# Altium project DHA-3v15.PrjPcb (part 1 of 3)
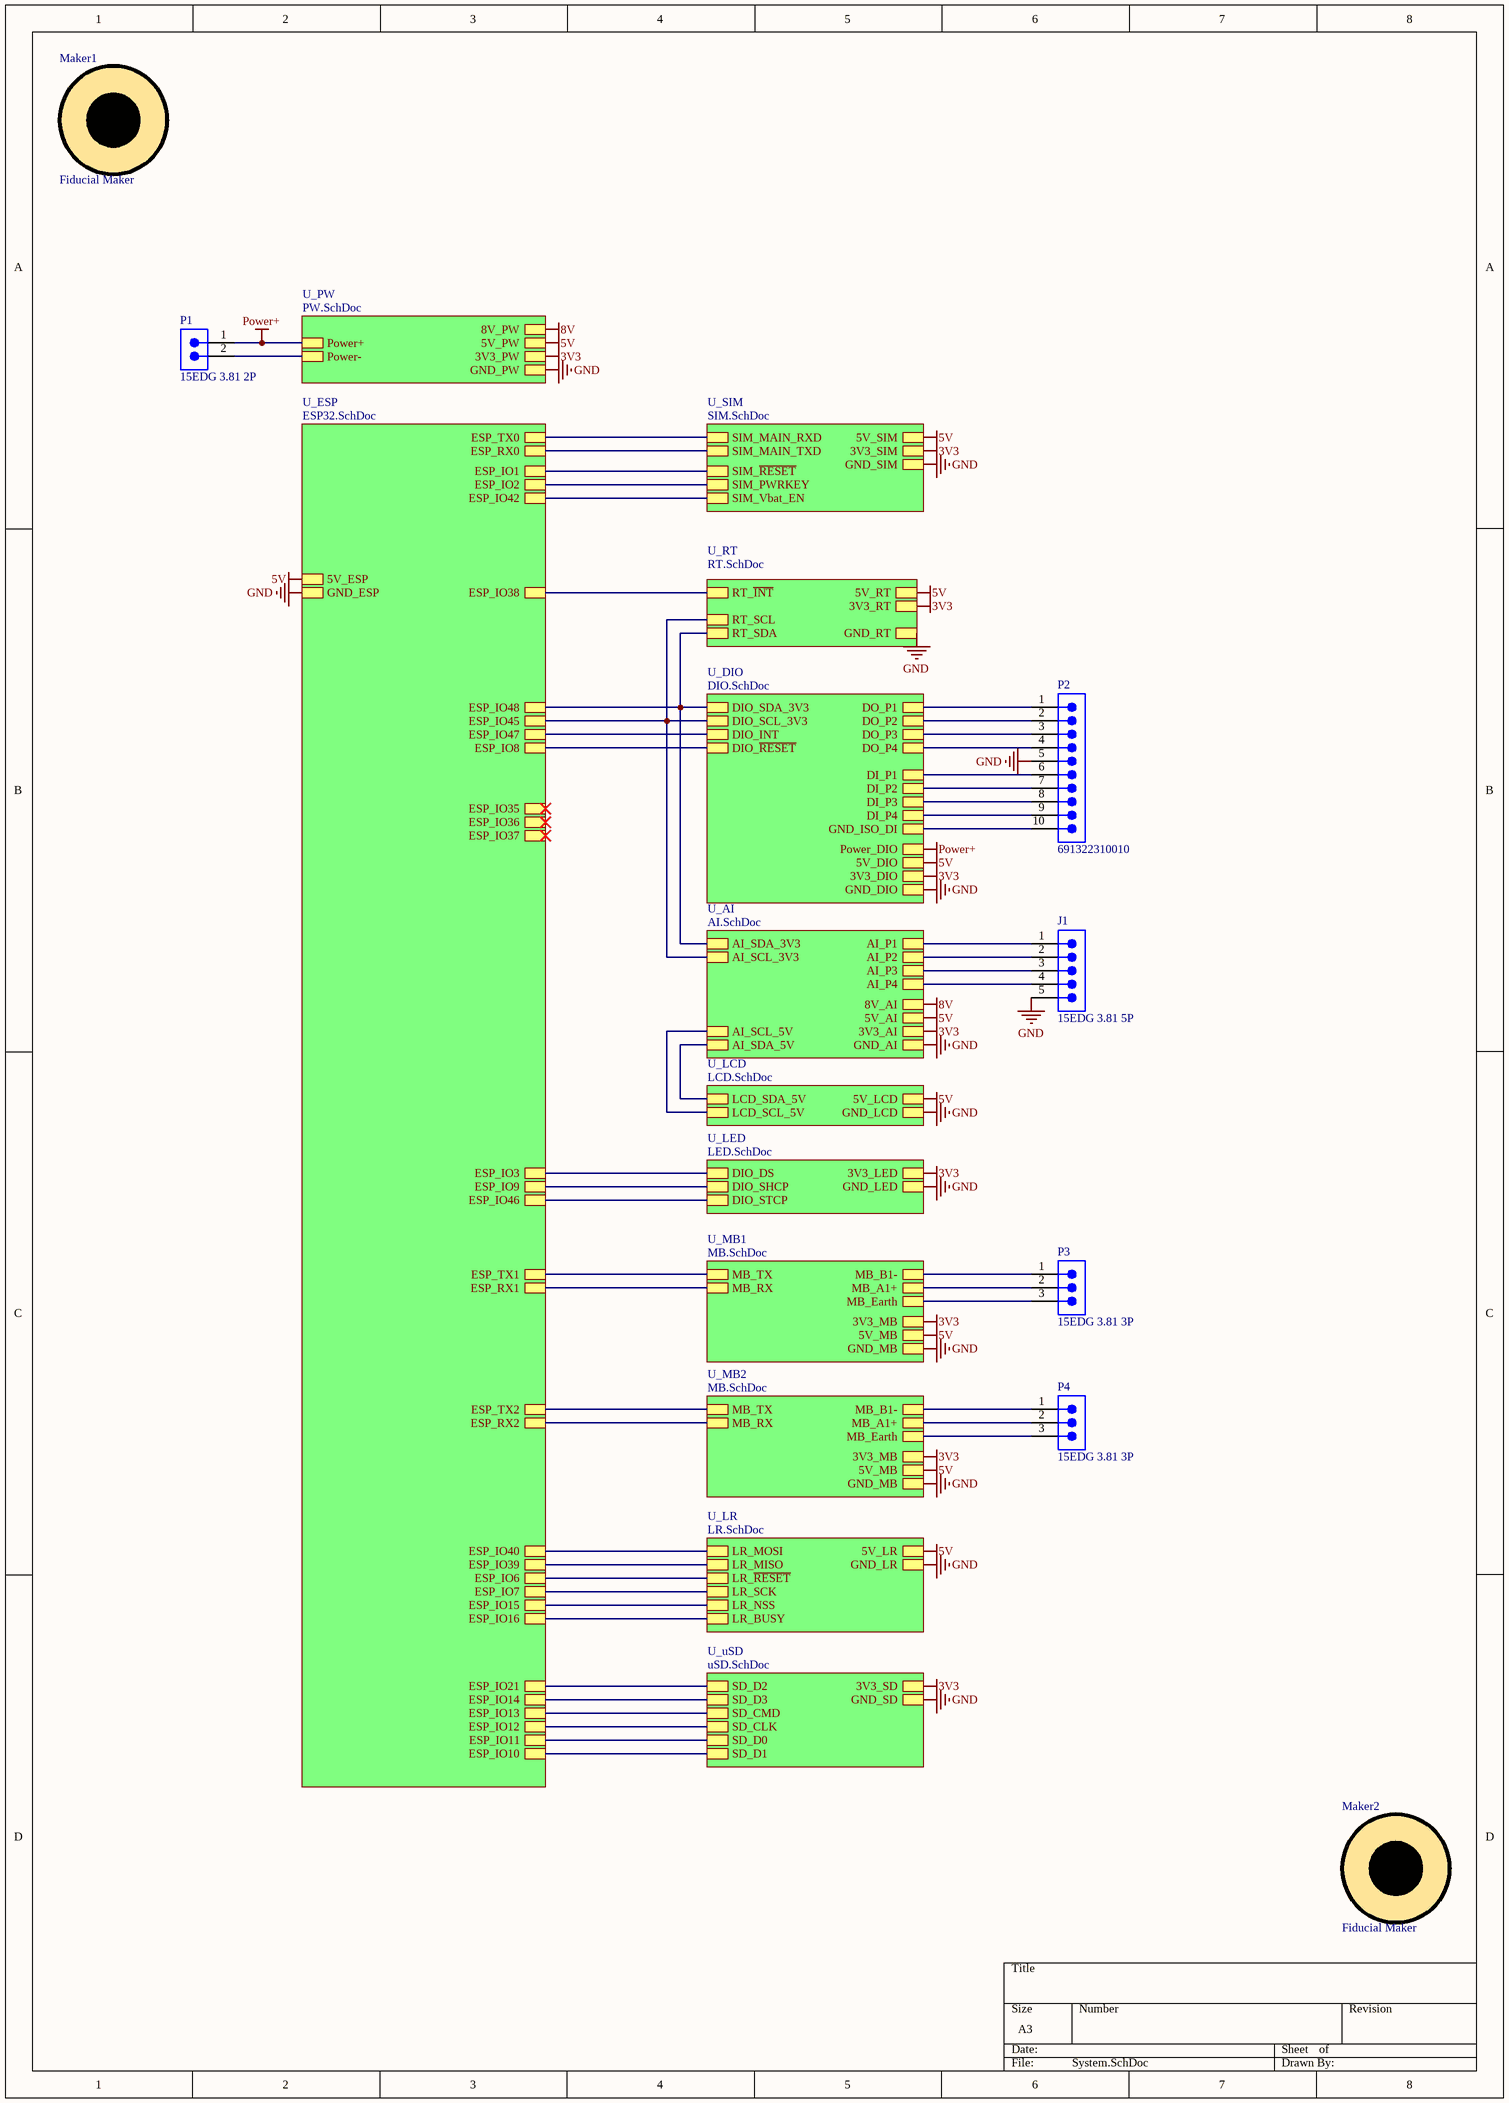
[diagram p0: System.SchDoc]
15 sheets, 321 parts. Net scope: hierarchical (ports join the sheet entries above them; power ports are global).
Board file: DHA-3v15.PcbDoc
Sheets:
  System.SchDoc
    U_MB1 = MB.SchDoc
    U_LR = LR.SchDoc
    U_uSD = uSD.SchDoc
    U_ESP = ESP32.SchDoc
    U_AI = AI.SchDoc
    U_PW = PW.SchDoc
      U_IP = IP.SchDoc
    U_SIM = SIM.SchDoc
    U_MB2 = MB.SchDoc
    U_LCD = LCD.SchDoc
    U_LED = LED.SchDoc
    U_DIO = DIO.SchDoc
      U_DO = DO.SchDoc
      U_DI = DI.SchDoc
    U_RT = RT.SchDoc

## Sheet System.SchDoc
size A3 portrait; SheetNumber: 1; SheetTotal: 15

### Parts
J1  15EDG 3.81 5P  [691322310005]
Maker1  Fiducial Maker  [Fiducial Maker]
Maker2  Fiducial Maker  [Fiducial Maker]
P1  15EDG 3.81 2P  [691322310002]
P2  691322310010  [691322310010]
P3  15EDG 3.81 3P  [691322310003]
P4  15EDG 3.81 3P  [691322310003]

### Sub-sheets
U_AI = AI.SchDoc: 3V3_AI, GND_AI, 8V_AI, 5V_AI, AI_P1, AI_P2, AI_P3, AI_P4, AI_SCL_5V, AI_SDA_5V, AI_SCL_3V3, AI_SDA_3V3
U_DIO = DIO.SchDoc: DIO_SCL_3V3, DIO_SDA_3V3, Power_DIO, 5V_DIO, 3V3_DIO, GND_DIO, DIO_INT, DO_P1, DO_P2, DO_P3, DO_P4, DI_P1, DI_P2, DI_P3, DI_P4, DIO_~{RESET}, GND_ISO_DI
U_ESP = ESP32.SchDoc: ESP_IO40, ESP_IO39, ESP_IO48, ESP_IO10, ESP_IO11, ESP_IO12, ESP_IO13, ESP_IO14, ESP_IO21, 5V_ESP, GND_ESP, ESP_RX2, ESP_TX2, ESP_IO47, ESP_TX1, ESP_RX1, ESP_IO3, ESP_IO45, ESP_IO8, ESP_IO6, ESP_IO15, ESP_IO16, ESP_IO7, ESP_IO9, ESP_IO46, ESP_IO35, ESP_IO36, ESP_IO37, ESP_IO38, ESP_RX0, ESP_TX0, ESP_IO1, ESP_IO42, ESP_IO2
U_LCD = LCD.SchDoc: GND_LCD, 5V_LCD, LCD_SDA_5V, LCD_SCL_5V
U_LED = LED.SchDoc: GND_LED, DIO_DS, DIO_SHCP, DIO_STCP, 3V3_LED
U_LR = LR.SchDoc: 5V_LR, GND_LR, LR_MISO, LR_SCK, LR_NSS, LR_BUSY, LR_~{RESET}, LR_MOSI
U_MB1 = MB.SchDoc: 5V_MB, GND_MB, MB_TX, MB_RX, MB_A1+, MB_B1-, MB_Earth, 3V3_MB
U_MB2 = MB.SchDoc: 5V_MB, GND_MB, MB_TX, MB_RX, MB_A1+, MB_B1-, MB_Earth, 3V3_MB
U_PW = PW.SchDoc: Power+, Power-, 5V_PW, GND_PW, 3V3_PW, 8V_PW
U_RT = RT.SchDoc: 3V3_RT, GND_RT, RT_SCL, RT_SDA, 5V_RT, RT_~{INT}
U_SIM = SIM.SchDoc: SIM_Vbat_EN, SIM_~{RESET}, SIM_MAIN_RXD, SIM_MAIN_TXD, 5V_SIM, GND_SIM, SIM_PWRKEY, 3V3_SIM
U_uSD = uSD.SchDoc: 3V3_SD, SD_D0, SD_D1, SD_D2, SD_D3, SD_CMD, SD_CLK, GND_SD

### Nets
3V3: sheet U_MB1/3V3_MB, sheet U_uSD/3V3_SD, sheet U_AI/3V3_AI, sheet U_PW/3V3_PW, sheet U_SIM/3V3_SIM, sheet U_MB2/3V3_MB, sheet U_LED/3V3_LED, sheet U_DIO/3V3_DIO, sheet U_RT/3V3_RT
5V: sheet U_MB1/5V_MB, sheet U_LR/5V_LR, sheet U_ESP/5V_ESP, sheet U_AI/5V_AI, sheet U_PW/5V_PW, sheet U_SIM/5V_SIM, sheet U_MB2/5V_MB, sheet U_LCD/5V_LCD, sheet U_DIO/5V_DIO, sheet U_RT/5V_RT
8V: sheet U_AI/8V_AI, sheet U_PW/8V_PW
GND: J1.5 P2.5 ; sheet U_MB1/GND_MB, sheet U_LR/GND_LR, sheet U_uSD/GND_SD, sheet U_ESP/GND_ESP, sheet U_AI/GND_AI, sheet U_PW/GND_PW, sheet U_SIM/GND_SIM, sheet U_MB2/GND_MB, sheet U_LCD/GND_LCD, sheet U_LED/GND_LED, sheet U_DIO/GND_DIO, sheet U_RT/GND_RT
GND_ISO_DI: P2.10 ; sheet U_DIO/GND_ISO_DI
Power+: P1.1 ; sheet U_PW/Power+, sheet U_DIO/Power_DIO
AI_P1: J1.1 ; sheet U_AI/AI_P1
AI_P2: J1.2 ; sheet U_AI/AI_P2
AI_P3: J1.3 ; sheet U_AI/AI_P3
AI_P4: J1.4 ; sheet U_AI/AI_P4
AI_SCL_3V3: sheet U_ESP/ESP_IO45, sheet U_AI/AI_SCL_3V3, sheet U_DIO/DIO_SCL_3V3, sheet U_RT/RT_SCL
AI_SCL_5V: sheet U_AI/AI_SCL_5V, sheet U_LCD/LCD_SCL_5V
AI_SDA_3V3: sheet U_ESP/ESP_IO48, sheet U_AI/AI_SDA_3V3, sheet U_DIO/DIO_SDA_3V3, sheet U_RT/RT_SDA
AI_SDA_5V: sheet U_AI/AI_SDA_5V, sheet U_LCD/LCD_SDA_5V
Earth1: P4.3 ; sheet U_MB2/MB_Earth
Earth1: P3.3 ; sheet U_MB1/MB_Earth  [a separate net that carries the same name]
LR_BUSY: sheet U_LR/LR_BUSY, sheet U_ESP/ESP_IO16
LR_MISO: sheet U_LR/LR_MISO, sheet U_ESP/ESP_IO39
LR_MOSI: sheet U_LR/LR_MOSI, sheet U_ESP/ESP_IO40
LR_NSS: sheet U_LR/LR_NSS, sheet U_ESP/ESP_IO15
LR_~{RESET}: sheet U_LR/LR_~{RESET}, sheet U_ESP/ESP_IO6
LR_SCK: sheet U_LR/LR_SCK, sheet U_ESP/ESP_IO7
MB_A1+: P4.2 ; sheet U_MB2/MB_A1+
MB_A1+: P3.2 ; sheet U_MB1/MB_A1+  [a separate net that carries the same name]
MB_B1-: P4.1 ; sheet U_MB2/MB_B1-
MB_B1-: P3.1 ; sheet U_MB1/MB_B1-  [a separate net that carries the same name]
SD_CLK: sheet U_uSD/SD_CLK, sheet U_ESP/ESP_IO12
SD_CMD: sheet U_uSD/SD_CMD, sheet U_ESP/ESP_IO13
SD_D0: sheet U_uSD/SD_D0, sheet U_ESP/ESP_IO11
SD_D1: sheet U_uSD/SD_D1, sheet U_ESP/ESP_IO10
SD_D2: sheet U_uSD/SD_D2, sheet U_ESP/ESP_IO21
SD_D3: sheet U_uSD/SD_D3, sheet U_ESP/ESP_IO14
NetD10_2: P2.1 ; sheet U_DIO/DO_P1
NetD12_2: P2.2 ; sheet U_DIO/DO_P2
NetD14_2: P2.3 ; sheet U_DIO/DO_P3
NetD16_2: P2.4 ; sheet U_DIO/DO_P4
NetD20_1: P1.2 ; sheet U_PW/Power-
NetDIBF_D1_2: P2.6 ; sheet U_DIO/DI_P1
NetDIBF_D2_2: P2.7 ; sheet U_DIO/DI_P2
NetDIBF_D3_2: P2.8 ; sheet U_DIO/DI_P3
NetDIBF_D4_2: P2.9 ; sheet U_DIO/DI_P4
NetMB_U1_U_MB1_1: sheet U_MB1/MB_TX, sheet U_ESP/ESP_TX1
NetMB_U1_U_MB2_1: sheet U_ESP/ESP_TX2, sheet U_MB2/MB_TX
NetQ7_3: sheet U_ESP/ESP_RX0, sheet U_SIM/SIM_MAIN_TXD
NetQ8_3: sheet U_ESP/ESP_TX0, sheet U_SIM/SIM_MAIN_RXD
NetR17_U_MB1_2: sheet U_MB1/MB_RX, sheet U_ESP/ESP_RX1
NetR17_U_MB2_2: sheet U_ESP/ESP_RX2, sheet U_MB2/MB_RX
NetR35_2: sheet U_ESP/ESP_IO1, sheet U_SIM/SIM_~{RESET}
NetR36_2: sheet U_ESP/ESP_IO2, sheet U_SIM/SIM_PWRKEY
NetR39_2: sheet U_ESP/ESP_IO42, sheet U_SIM/SIM_Vbat_EN
NetR92_1: sheet U_ESP/ESP_IO8, sheet U_DIO/DIO_~{RESET}
NetR93_1: sheet U_ESP/ESP_IO38, sheet U_RT/RT_~{INT}
NetU11_11: sheet U_ESP/ESP_IO9, sheet U_LED/DIO_SHCP
NetU11_12: sheet U_ESP/ESP_IO46, sheet U_LED/DIO_STCP
NetU11_14: sheet U_ESP/ESP_IO3, sheet U_LED/DIO_DS
NetU14_24: sheet U_ESP/ESP_IO47, sheet U_DIO/DIO_INT

### Library data of the parts
J1 = CMP-1502-01889-2: Cầu Đấu Terminal Cong 15EDG 3.81mm 5P; NexarPartId: 8917780; Gender: Male; Current: 10A; Number of Positions Per Level: 5; Voltage: 300V; Number of Levels: 1; Number of Rows: 1; Contact Plating: Tin; Contact Material: Brass; Length: 10.5mm; Lead Pitch: 3.81mm; Width: 20.44mm; Number of Pins: 5; Termination: Solder; Color: Green; Packaging: Box; Mount: Through Hole; REACH SVHC: Unknown; Height: 9.2mm; RoHS: Compliant; Pitch: 3.81mm; Number of Contacts: 5; ComponentLink1Description: New link; ComponentLink1URL: https://linhkienthanhcong.com/cau-dau-terminal-cong-15edg-3-81mm-5p
P1 = CMP-1502-01886-2: NexarPartId: 8917777; Number of Levels: 1; Voltage Rating: 300V; Gender: Male; Pitch: 3.81mm; Number of Positions Per Level: 2; Current Rating: 10A; Number of Pins: 2; Number of Rows: 1; Height: 7.2mm; Contact Material: Brass; Termination: Solder; Min Operating Temperature: -40°C; Max Operating Temperature: 105°C; Contact Plating: Tin; Number of Contacts: 2; REACH SVHC: Unknown; Color: Green; Packaging: Box; Voltage: 300V; Width: 9.01mm; Current: 10A; Length: 10.5mm; Mount: Through Hole; Lead Pitch: 3.81mm; RoHS: Compliant
P2 = CMP-1502-01894-2: NexarPartId: 46988695; Number of Contacts: 10; Gender: Male; Voltage Rating: 300V; Current Rating: 10A; Lead Pitch: 3.81mm; Number of Rows: 1; Contact Material: Tin; Height: 7.2mm; Min Operating Temperature: -40°C; Packaging: Box; Number of Pins: 10; Max Operating Temperature: 105°C
P3 P4 = CMP-1502-01887-2: NexarPartId: 8917778; Pitch: 3.81mm; Number of Positions Per Level: 3; Current: 10A; Voltage: 300V; Number of Levels: 1; Gender: Male; Termination: Solder; Number of Rows: 1; Contact Plating: Tin; Packaging: Box; Height: 9.2mm; Mount: Through Hole; Number of Contacts: 3; Width: 12.82mm; Lead Pitch: 3.81mm; REACH SVHC: Unknown; RoHS: Compliant; Length: 10.5mm; Number of Pins: 3; Color: Green; Contact Material: Brass

## Sheet MB.SchDoc
size A3; SheetNumber: 4; SheetTotal: 14
Used 2 times, as channels U_MB1, U_MB2. Parts and nets are listed once, with the designators drawn on the sheet.
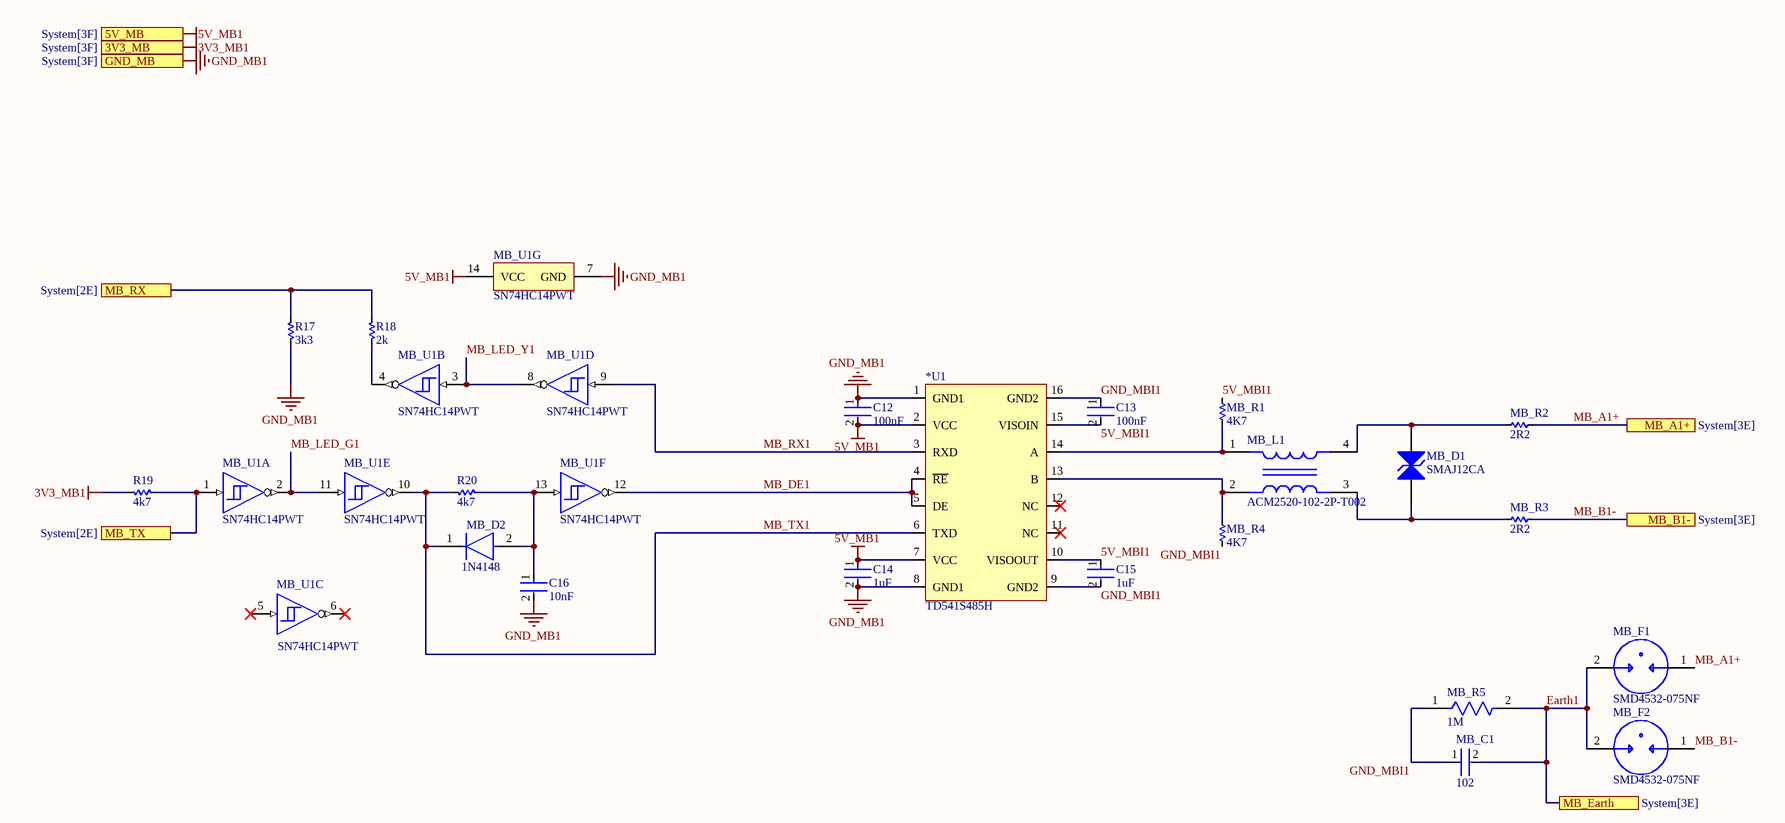
[diagram p1: MB.SchDoc]

### Parts
*U1  TD541S485H  [TD(H)541S485H]
C12  100nF  [FP-GRM21B-0_15-MFG]
C13  100nF  [FP-GRM21B-0_15-MFG]
C14  1uF  [FP-GRM21B-0_15-MFG]
C15  1uF  [FP-GRM21B-0_15-MFG]
C16  10nF  [FP-GRM21B-0_15-MFG]
MB_C1  102  [FP-GRM32-0_3-MFG]
MB_D1  SMAJ12CA  [VISH-DO-214AC-2_N]
MB_D2  1N4148  [FP-DO-213AA-MFG]
MB_F1  SMD4532-075NF  [FP-SG-MFG]
MB_F2  SMD4532-075NF  [FP-SG-MFG]
MB_L1  ACM2520-102-2P-T002  [FP-ACM2520-2P-MFG]
MB_R1  4K7  [RES-SMD-0805]
MB_R2  2R2  [RES-SMD-0805]
MB_R3  2R2  [RES-SMD-0805]
MB_R4  4K7  [RES-SMD-0805]
MB_R5  1M  [FP-RC1206-MFG]
MB_U1  SN74HC14PWT  [PW0014A_M]  (parts A,B,C,D,E,F,G of 7)
R17  3k3  [RES-SMD-0603]
R18  2k  [RES-SMD-0603]
R19  4k7  [RES-SMD-0603]
R20  4k7  [RES-SMD-0603]

### Ports
3V3_MB (see System[3F]), 5V_MB (see System[3F]), GND_MB (see System[3F]), MB_A1+ (see System[3E]), MB_B1- (see System[3E]), MB_Earth (see System[3E]), MB_RX (see System[2E]), MB_TX (see System[2E])

### Nets
3V3_MB1: R19.2 ; port 3V3_MB
5V_MB1: *U1.2(VCC) *U1.7(VCC) C12.2 C14.1 MB_U1.14(VCC) ; port 5V_MB
GND_MB1: *U1.1(GND1) *U1.8(GND1) C12.1 C14.2 C16.2 MB_U1.7(GND) R17.1 ; port GND_MB
5V_MBI1: *U1.10(VISOOUT) *U1.15(VISOIN) C13.2 C15.1 MB_R1.2
Earth1: MB_C1.2 MB_F1.2 MB_F2.2 MB_R5.2 ; port MB_Earth
GND_MBI1: *U1.9(GND2) *U1.16(GND2) C13.1 C15.2 MB_C1.1 MB_R4.1 MB_R5.1
MB_A1+: MB_F1.1 MB_R2.1 ; port MB_A1+
MB_B1-: MB_F2.1 MB_R3.1 ; port MB_B1-
MB_DE1: *U1.4(~{RE}) *U1.5(DE) MB_U1.12(~{6Y})
MB_LED_G1: MB_U1.2(~{1Y}) MB_U1.11(5A)
MB_LED_Y1: MB_U1.3(2A) MB_U1.8(~{4Y})
MB_RX: R17.2 R18.2 ; port MB_RX
MB_RX1: *U1.3(RXD) MB_U1.9(4A)
MB_TX: MB_U1.1(1A) R19.1 ; port MB_TX
MB_TX1: *U1.6(TXD) MB_D2.1(C) MB_U1.10(~{5Y}) R20.2
Net*U1_13: *U1.13(B) MB_L1.2 MB_R4.2
Net*U1_14: *U1.14(A) MB_L1.1 MB_R1.1
NetC16_1: C16.1 MB_D2.2(A) MB_U1.13(6A) R20.1
NetMB_D1_1: MB_D1.1(A1) MB_L1.3 MB_R3.2
NetMB_D1_2: MB_D1.2(A2) MB_L1.4 MB_R2.2
NetMB_U1_4: MB_U1.4(~{2Y}) R18.1

Not connected (* = marked no-connect by the designer): *U1 11(NC)* 12(NC)*; MB_U1 5(3A)* 6(~{3Y})*

### Channels
U_MB1: designators end in _U_MB1; ports 3V3_MB=3V3 5V_MB=5V GND_MB=GND MB_A1+=MB_A1+ MB_B1-=MB_B1- MB_Earth=Earth1 MB_RX=NetR17_U_MB1_2 MB_TX=NetMB_U1_U_MB1_1
U_MB2: designators end in _U_MB2; ports 3V3_MB=3V3 5V_MB=5V GND_MB=GND MB_A1+=MB_A1+ MB_B1-=MB_B1- MB_Earth=Earth1 MB_RX=NetR17_U_MB2_2 MB_TX=NetMB_U1_U_MB2_1

### Library data of the parts
*U1 = TD(H)541S485H: TD541S485H IC Transceiver RS-485/RS-422 DFN-16
C12-C16 = CMP-2007-03385-2: Cap 0805 10%; Material: Ceramic; Voltage: 6.3V; Dielectric: X5R; Tolerance: 20%; Capacitance: 22uF; Max Operating Temperature: 85°C; Min Operating Temperature: -55°C; Case/Package: 0805; Thickness: 0.053inch; Packaging: Tape and Reel; Depth: 1.25mm; Termination: SMD/SMT; Voltage Rating (DC): 6.3V; Radiation Hardening: No; Mount: Surface Mount; Lead Free: Lead Free; Package Quantity: 1; REACH SVHC: No SVHC; Voltage Rating: 6.3V; Length: 2mm; Case Code (Imperial): 0805; Case Code (Metric): 2012; Width: 0.049inch; Height: 1.25mm
MB_C1 = CMP-2000-05259-2: Tụ 1nF 1210 2000V 10%; 3DS Part Number: 220-00002; Manufacturer Part Number: GRM32ER60J107ME20L; Manufacturer: Murata; Voltage: 6.3V; Temperature Characteristic: X5R; Temperature Coefficient: 15%; Capacitance: 100uF; Value: 100uF; Tolerance: 20%; Octopart: https://octopart.com/grm32er60j107me20l-murata-197007; ComponentLink2URL: https://search.murata.co.jp/Ceramy/image/img/A01X/G101/ENG/GRM32ER60J107ME20-01.pdf; Temperature Range High: +85°C; RoHS: TRUE; Device Class L3: Ceramic Capacitors; Device Class L2: Capacitors; Package: GRM32-0.3; Voltage Rating: 6.3V; Category: Cap; Device Class L1: Passive Components; Automotive: No; Digikey Description: CAP CER 100UF 6.3V X5R 1210; Temperature: -55°C to +85°C; Height: 2.7mm; Ipc Land Pattern Name: CAPC320250X250; Material: Ceramic; Temperature Range Low: -55°C; Lead Free: Yes; ComponentLink2Description: Datasheet
MB_D1 = CMP-0548-00198-4: SMAJ12CA TVS DIODE 12VWM 19.9VC DO214AC; Manufacturer: Vishay Semiconductor; PartNumber: SMAJ8.5CA-E3/61; VBR Bi-Directional (V): 6.4 to 231; VWM (V): 8.5; ID (uA): 20; Packing: Tape and Reel; PPPM (W): 400, 300; IFSM: 40 A; DatasheetVersion: 12/8/2013; ComponentLink3URL: http://www.vishay.com/docs/88390/smaj50a.pdf; ComponentLink2Description: Datasheet; PackageReference: DO-214AC-2; PackageDescription: 2-Pin DO-214AC (SMA), Body 4.245 x 2.665 mm; RoHS: TRUE; Mounting Technology: Surface Mount; ComponentLink3Description: Package Specification; ComponentLink1Description: Manufacturer URL; Operating Junction and Storage Temperature Range: -55 to 150 degC; ComponentLink2URL: http://www.vishay.com/docs/88390/smaj50a.pdf; ComponentLink1URL: http://www.vishay.com/
MB_D2 = CMP-2000-07607-2: 1N4148 LL4148 SOD-80/1206 SMD; Manufacturer Part Number: JANTX1N4148UR-1; Manufacturer: Microsemi; Max Junction Temp: +175°C; Max Repetitive Reverse Voltage: 75V; Value: 4pF; Reverse Voltage: 100V; Forward Current: 200mA; Max Surge Forward Current: 2A; Temperature: -65°C to +175°C; Device Class L2: Diodes; Capacitance: 4pF; Octopart: https://octopart.com/jantx1n4148ur-1-microsemi-6804654; Height: 1.7mm; Automotive: No; Digikey Description: DIODE GEN PURP 75V 200MA DO213AA; Device Class L1: Discrete Semiconductors; Package: DO-213AA; Category: Diode; ComponentLink2URL: https://www.microsemi.com/document-portal/doc_download/125215-lds-0281-1-datasheet; Device Class L3: Rectifier Diodes; Temperature Range Low: -65°C; Temperature Range High: +175°C; Mouser Description: Diodes - General Purpose, Power, Switching Switching; RoHS: FALSE; Lead Free: No; ComponentLink2Description: Datasheet
MB_F1 MB_F2 = CMP-08601-000002-1: Fail Short: No; Number of Terminals/Pins: 2; REACH SVHC: No SVHC; Case Code (Imperial): 1812; Case/Package: 1812; Mount: Surface Mount; RoHS Compliant: Yes; Number of Pins: 2; Package Quantity: 2000; Length: 4.5mm; Number of Poles: 2; Min Operating Temperature: -40°C; Case Code (Metric): 4532; Max Operating Temperature: 90°C; Depth: 3.2mm; Termination: SMD/SMT; Packaging: Tape and Reel; Series: SG
MB_L1 = CMP-08256-000012-1: ACM2520-102-2P-T002 CMC 200MA 2LN 1KOHM SMD; DC Resistance-Max: 350mR; Number of Lines: 2; Current Rating: 400mA; Impedance: 300R; Voltage Rating: 20V; Test Frequency: 100MHz; Series: ACM; Termination: SMD/SMT; Width: 0.079inch; Mount: Surface Mount; DC Resistance (DCR): 350mR; Lead Free: Lead Free; Max DC Current: 400mA; Package Quantity: 1; REACH SVHC: No SVHC; Min Operating Temperature: -40°C; Packaging: Tape and Reel; Max Operating Temperature: 85°C; Height: 0.051inch; Case/Package: 1008; Length: 0.098inch; RoHS Compliant: Yes; Current: 400mA
MB_R1-MB_R4 = Res-SMD: Res 0805 5%; Manufacturer: Generic Components; Class: Passive; Published: 08/06/2000; Publisher: Altium Hobart Technology Centre
MB_R5 = CMP-2100-03681-2: RES SMD 1/4W 1206; Manufacturer Part Number: RC1206JR-070RL; Manufacturer: YAGEO; Voltage Rating: 200V; Temperature Coefficient: 300ppm/°C; Power Rating: 0.25W; Value: 0Ω; Tolerance: 5%; Temperature Range Low: -55°C; Category: Res; Automotive: No; Ipc Land Pattern Name: RESC310160X55; Device Class L1: Passive Components; Temperature: -55°C to +155°C; ComponentLink2URL: https://www.yageo.com/upload/media/product/productsearch/datasheet/rchip/PYu-RC_Group_51_RoHS_L_10.pdf; Lead Free: Yes; Height: 0.65mm; Footprint Url: https://www.yageo.com/upload/website/yageo_PYu-R_Mount_10_19050818_343.pdf; Package: RC1206; Digikey Description: RES SMD 0 OHM JUMPER 1/4W 1206; Temperature Range High: +155°C; Device Class L3: Chip SMD Resistors; Device Class L2: Resistors; Octopart: https://octopart.com/rc1206jr-070rl-yageo-40025601; Resistance: 0Ω; Series: RC; ComponentLink2Description: Datasheet; Composition: Thick Film; RoHS: TRUE; Mouser Description: Resistor: thick film; SMD; 1206; 0O; 0.25W; ±5%; -55÷155°C
MB_U1 = CMP-1615-00108-4: Hex Schmitt-Trigger Inverters, PW0014A, SMALL T&R; Manufacturer: Texas Instruments; F @ Nom Voltage(Max)(Mhz): 20; Input Type: CMOS; VCC(Min)(V): 2; Bits(#): 6; Output Drive (IOL/IOH)(Max)(mA): -4/4; Technology Family: HC; Rating: Catalog; Voltage(Nom)(V): 5; ICC @ Nom Voltage(Max)(mA): 0.02; Schmitt Trigger: Yes; tpd @ Nom Voltage(Max)(ns): 31; Operating Temperature Range(C): -40 to 85; Output Type: CMOS; DatasheetVersion: SCLS085G; Generic Part Number: SN74HC14; VCC(Max)(V): 6; Code_JEDEC: MO-153; PackageReference: PW0014A
R17-R20 = Res-SMD: Res 0603 5%; Manufacturer: Generic Components; Class: Passive; Published: 08/06/2000; Publisher: Altium Hobart Technology Centre

## Sheet LR.SchDoc
size 165 x 203 mm; SheetNumber: 11; SheetTotal: 15
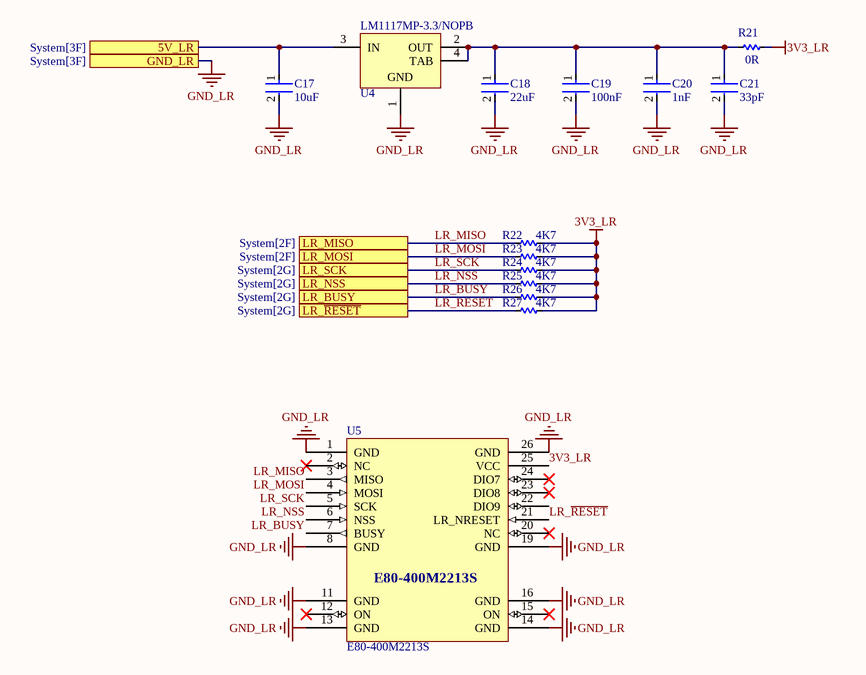
[diagram p2: LR.SchDoc]

### Parts
C17  10uF  [FP-GRM188-0_1-e0_2_0_55-IPC_A]
C18  22uF  [FP-GRM188-0_1-e0_2_0_55-IPC_A]
C19  100nF  [FP-GRM188-0_1-e0_2_0_55-IPC_A]
C20  1nF  [FP-GRM188-0_1-e0_2_0_55-IPC_A]
C21  33pF  [FP-GRM188-0_1-e0_2_0_55-IPC_A]
R21  0R  [RES-SMD-0603]
R22  4K7  [RES-SMD-0603]
R23  4K7  [RES-SMD-0603]
R24  4K7  [RES-SMD-0603]
R25  4K7  [RES-SMD-0603]
R26  4K7  [RES-SMD-0603]
R27  4K7  [RES-SMD-0603]
U4  LM1117MP-3.3/NOPB  [DCY0004A_M]
U5  E80-400M2213S  [E80-400M2213S]

### Ports
5V_LR (see System[3F]), GND_LR (see System[3F]), LR_BUSY (see System[2G]), LR_MISO (see System[2F]), LR_MOSI (see System[2F]), LR_NSS (see System[2G]), LR_SCK (see System[2G]), LR_~{RESET} (see System[2G])

### Nets
3V3_LR: R21.2 R22.2 R23.2 R24.2 R25.2 R26.2 R27.2 U5.25(VCC)
5V: C17.1 U4.3(IN) ; port 5V_LR
GND_LR: C17.2 C18.2 C19.2 C20.2 C21.2 U4.1(GND) U5.1(GND) U5.8(GND) U5.11(GND) U5.13(GND) U5.14(GND) U5.16(GND) U5.19(GND) U5.26(GND) ; port GND_LR  [project net GND]
LR_BUSY: R26.1 U5.7(BUSY) ; port LR_BUSY
LR_MISO: R22.1 U5.3(MISO) ; port LR_MISO
LR_MOSI: R23.1 U5.4(MOSI) ; port LR_MOSI
LR_NSS: R25.1 U5.6(NSS) ; port LR_NSS
LR_~{RESET}: R27.1 U5.21(LR_NRESET) ; port LR_~{RESET}
LR_SCK: R24.1 U5.5(SCK) ; port LR_SCK
NetC18_1: C18.1 C19.1 C20.1 C21.1 R21.1 U4.2(OUT) U4.4(TAB)

Not connected (* = marked no-connect by the designer): U5 2(NC)* 12(ON)* 15(ON)* 20(NC)* 22(DIO9) 23(DIO8)* 24(DIO7)*

### Library data of the parts
C17 = CMP-2006-02792-2: Chip Multilayer Ceramic Capacitors for General Purpose, 0603; Voltage Rating (DC): 6.3V; Dielectric: X5R; Tolerance: 20%; Packaging: Tape and Reel; Width: 0.031inch; Termination: SMD/SMT; Package Quantity: 4000; Voltage Rating: 6.3V; Capacitance: 10uF; Case/Package: 0603; Min Operating Temperature: -55°C; Voltage: 6.3V; Length: 1.6mm; Thickness: 0.035inch; Lead Free: Lead Free; Depth: 0.8mm; Case Code (Imperial): 0603; Max Operating Temperature: 85°C; Material: Ceramic; Height: 0.8mm; Mount: Surface Mount; REACH SVHC: No SVHC; Radiation Hardening: No; Case Code (Metric): 1608
C18-C21 = CMP-2006-02792-2: Chip Multilayer Ceramic Capacitors for General Purpose, 0603; Voltage Rating (DC): 6.3V; Dielectric: X5R; Capacitance: 10uF; Tolerance: 20%; Packaging: Tape and Reel; Width: 0.031inch; Termination: SMD/SMT; Package Quantity: 4000; Voltage Rating: 6.3V; Case/Package: 0603; Min Operating Temperature: -55°C; Voltage: 6.3V; Length: 1.6mm; Thickness: 0.035inch; Lead Free: Lead Free; Depth: 0.8mm; Case Code (Imperial): 0603; Max Operating Temperature: 85°C; Material: Ceramic; Height: 0.8mm; Mount: Surface Mount; REACH SVHC: No SVHC; Radiation Hardening: No; Case Code (Metric): 1608
R21-R27 = Res-SMD: as R17 on sheet MB; Published: 08/06/2000; Publisher: Altium Hobart Technology Centre
U4 = CMP-0062-01638-4: 800mA Low-Dropout Linear Regulator, 4-pin SOT-223, Pb-Free; Manufacturer: Texas Instruments; CompType: LDO IC; PackageTopMarking: XYTT*N05A; High-Reliability: Y; PowerWise: N; ComponentLink1URL: http://www.ti.com/general/docs/lit/getliterature.tsp?genericPartNumber=LM1117-N&fileType=pdf; PinCount: 4; PackageDescription: Molded SOT-223, 6.50 x 3.56 x 1.6mm Body, 4 Lead, 2.3mm Pitch; Code_IPC: SOT223-4; PartNumber: LM1117MP-3.3/NOPB; Code_JEDEC: TO-261-AA; RoHS: Y; PackageReference: DCY0004A; ComponentLink1Description: Datasheet URL
U5 = E80-400M2213S: https://www.cdebyte.com/products/E80-400M2213S/2#Pin

## Sheet uSD.SchDoc
size A4; SheetNumber: 14; SheetTotal: 14
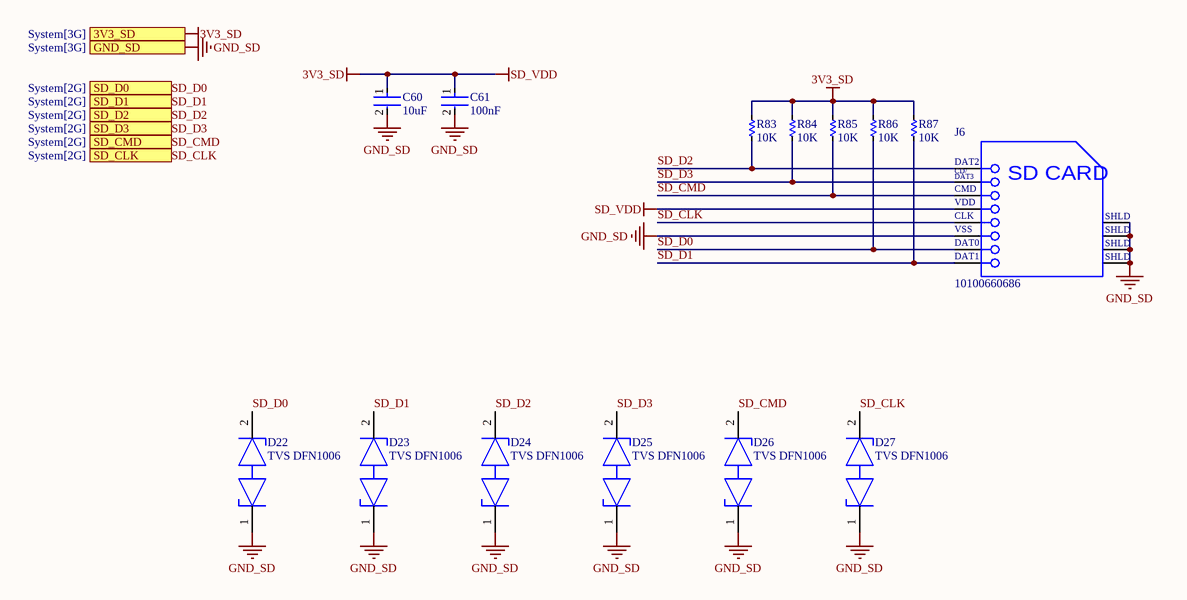
[diagram p3: uSD.SchDoc]

### Parts
C60  10uF  [FP-GRM18-0_15-MFG]
C61  100nF  [FP-GRM18-0_15-MFG]
D22  TVS DFN1006  [FP-SOD882-CA-MFG]
D23  TVS DFN1006  [FP-SOD882-CA-MFG]
D24  TVS DFN1006  [FP-SOD882-CA-MFG]
D25  TVS DFN1006  [FP-SOD882-CA-MFG]
D26  TVS DFN1006  [FP-SOD882-CA-MFG]
D27  TVS DFN1006  [FP-SOD882-CA-MFG]
J6  10100660686  [AMPH-10100660686_V]
R83  10K  [RES-SMD-0603]
R84  10K  [RES-SMD-0603]
R85  10K  [RES-SMD-0603]
R86  10K  [RES-SMD-0603]
R87  10K  [RES-SMD-0603]

### Ports
3V3_SD (see System[3G]), GND_SD (see System[3G]), SD_CLK (see System[2G]), SD_CMD (see System[2G]), SD_D0 (see System[2G]), SD_D1 (see System[2G]), SD_D2 (see System[2G]), SD_D3 (see System[2G])

### Nets
3V3_SD: C60.1 C61.1 J6.4(VDD) R83.2 R84.2 R85.2 R86.2 R87.2 ; port 3V3_SD  [also labelled SD_VDD]  [project net 3V3]
GND_SD: C60.2 C61.2 D22.1(K1) D23.1(K1) D24.1(K1) D25.1(K1) D26.1(K1) D27.1(K1) J6.6(VSS) J6.9(SHLD) J6.10(SHLD) J6.11(SHLD) J6.12(SHLD) ; port GND_SD  [project net GND]
SD_CLK: D27.2(K2) J6.5(CLK) ; port SD_CLK
SD_CMD: D26.2(K2) J6.3(CMD) R85.1 ; port SD_CMD
SD_D0: D22.2(K2) J6.7(DAT0) R86.1 ; port SD_D0
SD_D1: D23.2(K2) J6.8(DAT1) R87.1 ; port SD_D1
SD_D2: D24.2(K2) J6.1(DAT2) R83.1 ; port SD_D2
SD_D3: D25.2(K2) J6.2(CD/DAT3) R84.1 ; port SD_D3

### Notes on the sheet
- (in symbol CMP-2000-05564-1) CD/; DAT3; SD CARD

### Library data of the parts
C60 = CMP-2000-05448-2: CAP CER 10V X5R 0603; Manufacturer Part Number: GRM188R61A106KE69D; Manufacturer: Murata; Temperature Coefficient: 15%; Material: Ceramic; Tolerance: 10%; Device Class L1: Passive Components; ComponentLink2Description: Datasheet; Height: 0.95mm; Package: GRM18-0.15; Octopart: https://octopart.com/grm188r61a106ke69d-murata-22851381; Value: 10uF; Digikey Description: CAP CER 10UF 10V X5R 0603; Temperature Range High: +85°C; Temperature Range Low: -55°C; Temperature Characteristic: X5R; Capacitance: 10uF; RoHS: TRUE; Device Class L2: Capacitors; ComponentLink2URL: https://search.murata.co.jp/Ceramy/image/img/A01X/G101/ENG/GRM188R61A106KE69-01A.pdf; Device Class L3: Ceramic Capacitors; Lead Free: Yes; Mouser Description: Multilayer Ceramic Capacitors MLCC - SMD/SMT 0603 10uF 10volts X5R + - 10%; Category: Cap; Voltage Rating: 10V; Temperature: -55°C to +85°C; Automotive: No
C61 = CMP-2000-05448-2: CAP CER 10V X5R 0603; Manufacturer Part Number: GRM188R61A106KE69D; Manufacturer: Murata; Temperature Coefficient: 15%; Value: 10uF; Material: Ceramic; Tolerance: 10%; Device Class L1: Passive Components; ComponentLink2Description: Datasheet; Height: 0.95mm; Package: GRM18-0.15; Octopart: https://octopart.com/grm188r61a106ke69d-murata-22851381; Digikey Description: CAP CER 10UF 10V X5R 0603; Temperature Range High: +85°C; Temperature Range Low: -55°C; Temperature Characteristic: X5R; Capacitance: 10uF; RoHS: TRUE; Device Class L2: Capacitors; ComponentLink2URL: https://search.murata.co.jp/Ceramy/image/img/A01X/G101/ENG/GRM188R61A106KE69-01A.pdf; Device Class L3: Ceramic Capacitors; Lead Free: Yes; Mouser Description: Multilayer Ceramic Capacitors MLCC - SMD/SMT 0603 10uF 10volts X5R + - 10%; Category: Cap; Voltage Rating: 10V; Temperature: -55°C to +85°C; Automotive: No
D22-D27 = CMP-14436-000021-1: PESDNC2FD3V3B TVS DIODE DFN1006; RoHS Compliant: Yes; ComponentLink1Description: New link; ComponentLink1URL: https://linhkien.cxtvn.com/9728-pesdnc2fd3v3b-tvs-diode-dfn1006.html
J6 = CMP-2000-05564-1: Micro SD Card Reader, -25 to 85 degC, 9-Pin SMD, RoHS, Tape and Reel; Manufacturer: Amphenol; Pitch: 1.1mm; Package Version: Rev. G, 10/2012; No. of Positions: 9; Package Description: 9-Pin Micro Secure Digital Card, Pitch 1.1 mm; Datasheet URL: https://www.amphenolcanada.com/ProductSearch/drawings/AC/10100660686.pdf; Orientation: RightAngle; Mounting Technology: SurfaceMount; Manufacturer URL: http://www.amphenol.com/; Package URL: https://www.amphenolcanada.com/ProductSearch/drawings/AC/10100660686.pdf; Temperature Min: -25degC; Package Reference: 10100660686; Temperature Max: 85degC; PartNumber: 10100660; Packing: TapeandReel; RoHS: TRUE; Datasheet Version: Rev. G, 10/2012
R83-R87 = Res-SMD: as R17 on sheet MB; Published: 08/06/2000; Publisher: Altium Hobart Technology Centre

## Sheet ESP32.SchDoc
size A3; SheetNumber: 2; SheetTotal: 15
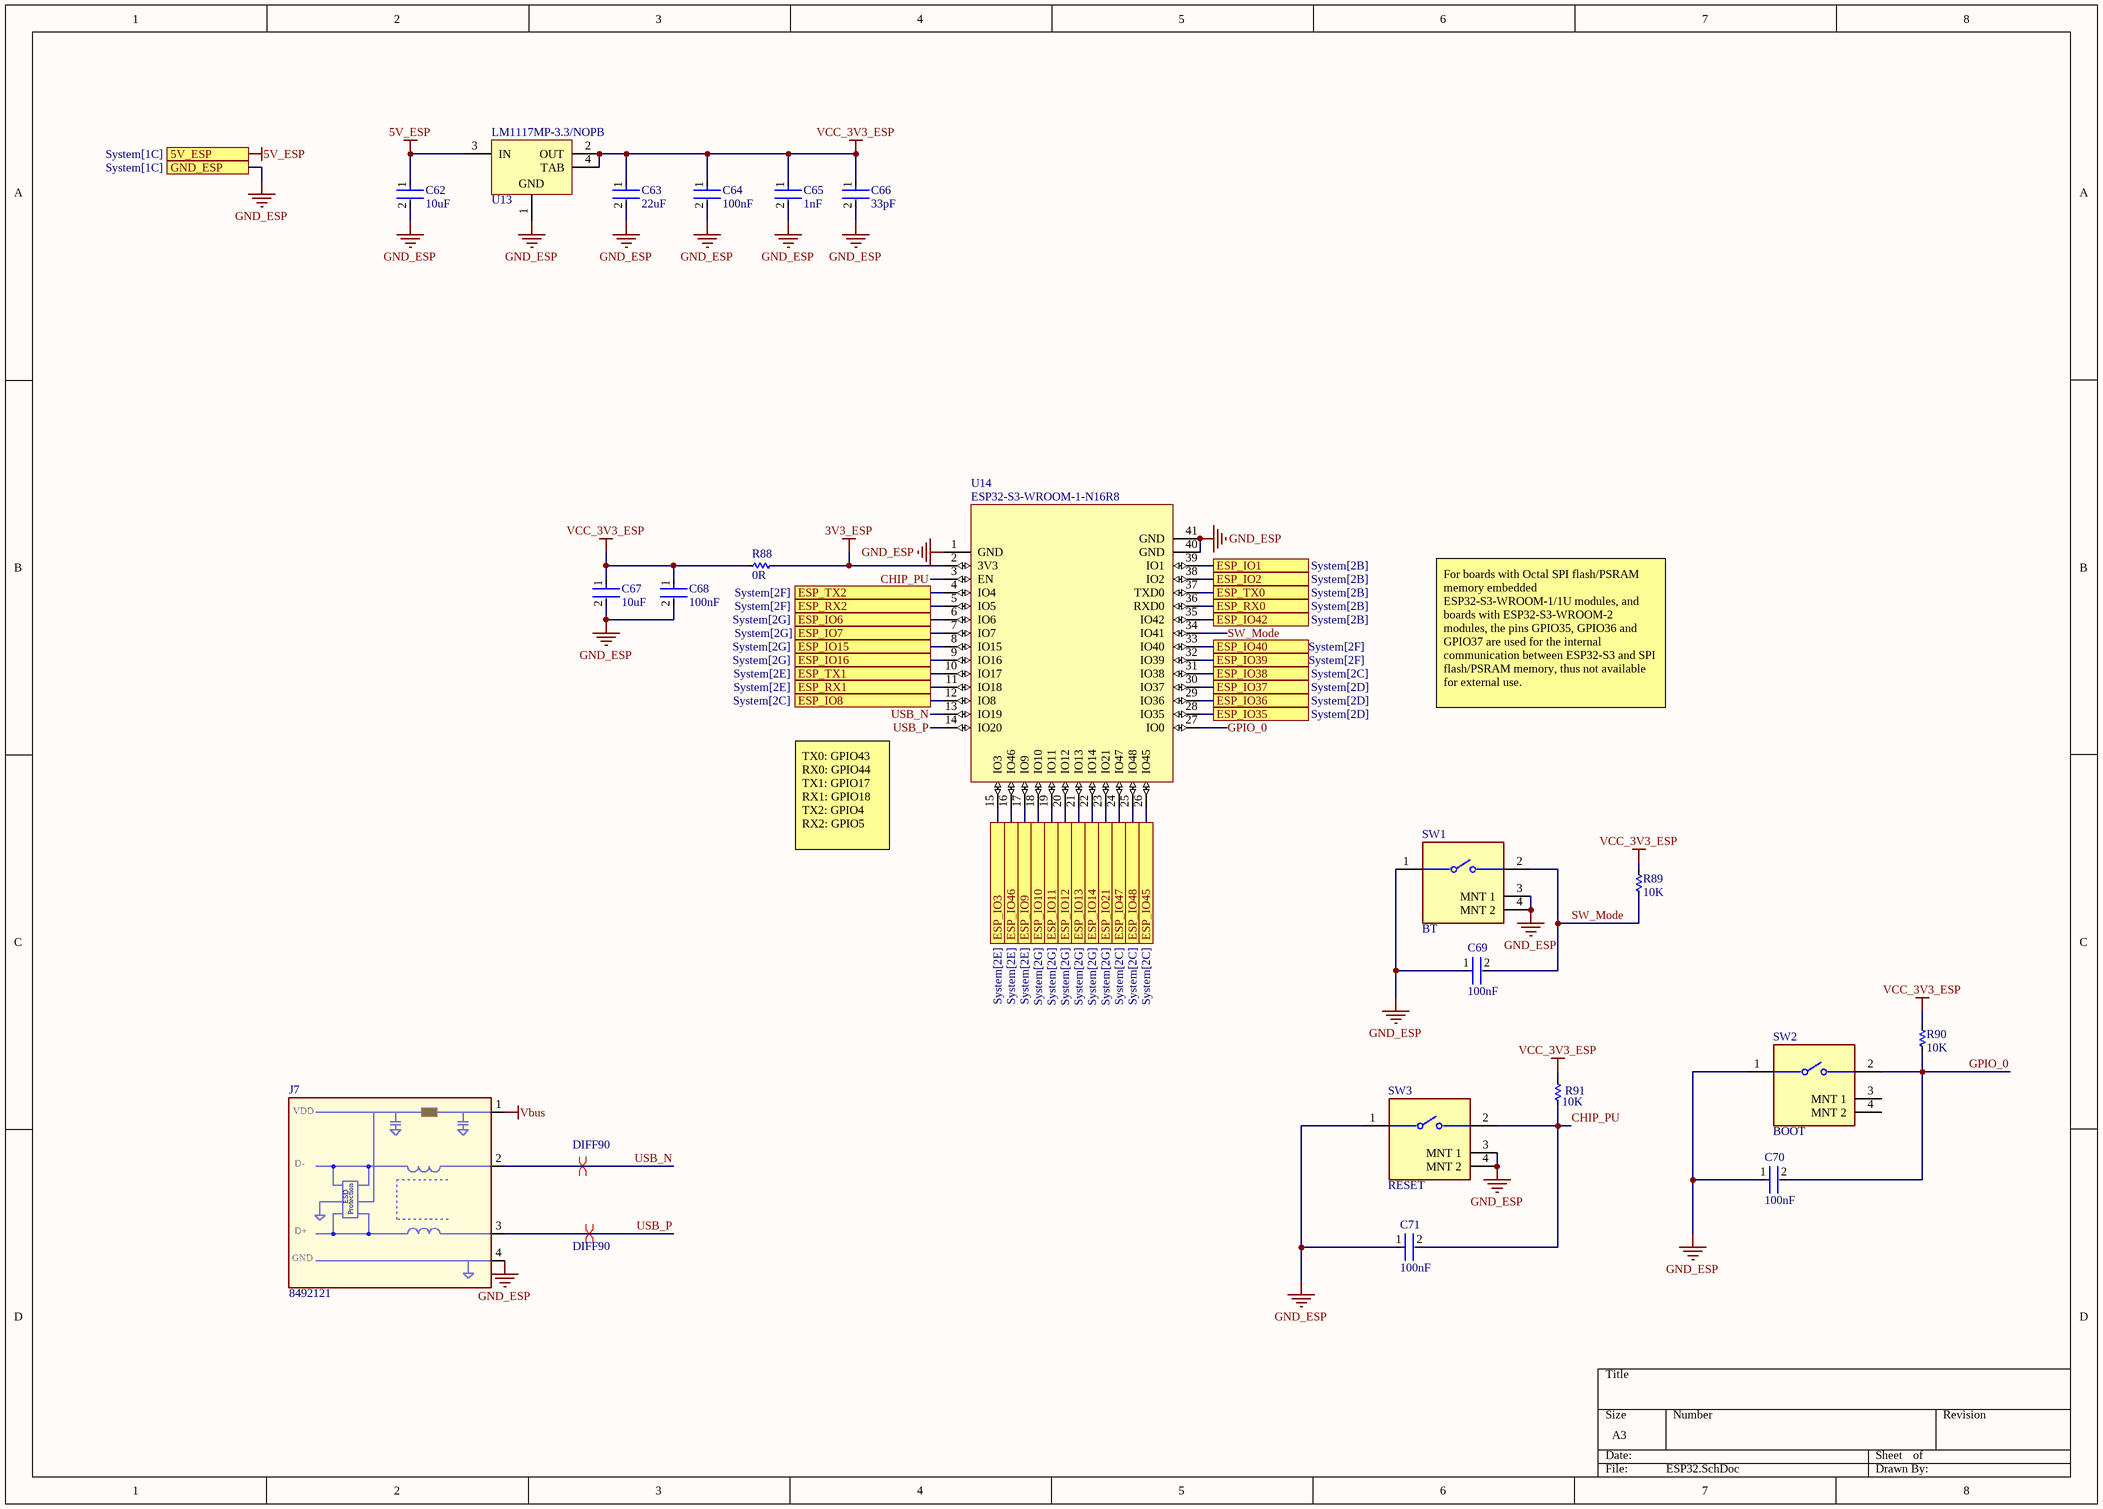
[diagram p4: ESP32.SchDoc]

### Parts
C62  10uF  [FP-GRM188-0_1-e0_2_0_55-IPC_A]
C63  22uF  [FP-GRM188-0_1-e0_2_0_55-IPC_A]
C64  100nF  [FP-GRM188-0_1-e0_2_0_55-IPC_A]
C65  1nF  [FP-GRM188-0_1-e0_2_0_55-IPC_A]
C66  33pF  [FP-GRM188-0_1-e0_2_0_55-IPC_A]
C67  10uF  [FP-GRM188-0_1-e0_2_0_55-IPC_A]
C68  100nF  [FP-GRM188-0_1-e0_2_0_55-IPC_A]
C69  100nF  [FP-GRM188-0_1-e0_2_0_55-IPC_A]
C70  100nF  [FP-CGA3E-0_3-0_1-IPC_A]
C71  100nF  [FP-CGA3E-0_3-0_1-IPC_A]
J7  8492121  [USB-C2]
R88  0R  [RES-SMD-0603]
R89  10K  [RES-SMD-0603]
R90  10K  [RES-SMD-0603]
R91  10K  [RES-SMD-0603]
SW1  BT  [FP-1825027-8-MFG]
SW2  BOOT  [FP-1825027-8-MFG]
SW3  RESET  [FP-1825027-8-MFG]
U13  LM1117MP-3.3/NOPB  [DCY0004A_M]
U14  ESP32-S3-WROOM-1-N16R8  [ESP32S3WROOM1N8R2]

### Ports
5V_ESP (see System[1C]), ESP_IO1 (see System[2B]), ESP_IO2 (see System[2B]), ESP_IO3 (see System[2E]), ESP_IO6 (see System[2G]), ESP_IO7 (see System[2G]), ESP_IO8 (see System[2C]), ESP_IO9 (see System[2E]), ESP_IO10 (see System[2G]), ESP_IO11 (see System[2G]), ESP_IO12 (see System[2G]), ESP_IO13 (see System[2G]), ESP_IO14 (see System[2G]), ESP_IO15 (see System[2G]), ESP_IO16 (see System[2G]), ESP_IO21 (see System[2G]), ESP_IO35 (see System[2D]), ESP_IO36 (see System[2D]), ESP_IO37 (see System[2D]), ESP_IO38 (see System[2C]), ESP_IO39 (see System[2F]), ESP_IO40 (see System[2F]), ESP_IO42 (see System[2B]), ESP_IO45 (see System[2C]), ESP_IO46 (see System[2E]), ESP_IO47 (see System[2C]), ESP_IO48 (see System[2C]), ESP_RX0 (see System[2B]), ESP_RX1 (see System[2E]), ESP_RX2 (see System[2F]), ESP_TX0 (see System[2B]), ESP_TX1 (see System[2E]), ESP_TX2 (see System[2F]), GND_ESP (see System[1C])

### Nets
3V3_ESP: R88.1 U14.2(3V3)
5V_ESP: C62.1 U13.3(IN) ; port 5V_ESP  [project net 5V]
GND_ESP: C62.2 C63.2 C64.2 C65.2 C66.2 C67.2 C68.2 C69.1 C70.1 C71.1 J7.4(GND) SW1.1 SW1.3(MNT_1) SW1.4(MNT_2) SW2.1 SW3.1 SW3.3(MNT_1) SW3.4(MNT_2) U13.1(GND) U14.1(GND) U14.40(GND) U14.41(GND) ; port GND_ESP  [project net GND]
Vbus: J7.1(VBUS)
VCC_3V3_ESP: C63.1 C64.1 C65.1 C66.1 C67.1 C68.1 R88.2 R89.2 R90.2 R91.2 U13.2(OUT) U13.4(TAB)
AI_SCL_3V3: U14.26(IO45) ; port ESP_IO45
AI_SDA_3V3: U14.25(IO48) ; port ESP_IO48
CHIP_PU: C71.2 R91.1 SW3.2 U14.3(EN)
GPIO_0: C70.2 R90.1 SW2.2 U14.27(IO0)
LR_BUSY: U14.9(IO16) ; port ESP_IO16
LR_MISO: U14.32(IO39) ; port ESP_IO39
LR_MOSI: U14.33(IO40) ; port ESP_IO40
LR_NSS: U14.8(IO15) ; port ESP_IO15
LR_~{RESET}: U14.6(IO6) ; port ESP_IO6
LR_SCK: U14.7(IO7) ; port ESP_IO7
SD_CLK: U14.20(IO12) ; port ESP_IO12
SD_CMD: U14.21(IO13) ; port ESP_IO13
SD_D0: U14.19(IO11) ; port ESP_IO11
SD_D1: U14.18(IO10) ; port ESP_IO10
SD_D2: U14.23(IO21) ; port ESP_IO21
SD_D3: U14.22(IO14) ; port ESP_IO14
SW_Mode: C69.2 R89.1 SW1.2 U14.34(IO41)
USB_N: J7.2(D-) U14.13(IO19)
USB_P: J7.3(D+) U14.14(IO20)
NetMB_U1_U_MB1_1: U14.10(IO17) ; port ESP_TX1
NetMB_U1_U_MB2_1: U14.4(IO4) ; port ESP_TX2
NetQ7_3: U14.36(RXD0) ; port ESP_RX0
NetQ8_3: U14.37(TXD0) ; port ESP_TX0
NetR17_U_MB1_2: U14.11(IO18) ; port ESP_RX1
NetR17_U_MB2_2: U14.5(IO5) ; port ESP_RX2
NetR35_2: U14.39(IO1) ; port ESP_IO1
NetR36_2: U14.38(IO2) ; port ESP_IO2
NetR39_2: U14.35(IO42) ; port ESP_IO42
NetR92_1: U14.12(IO8) ; port ESP_IO8
NetR93_1: U14.31(IO38) ; port ESP_IO38
NetU11_11: U14.17(IO9) ; port ESP_IO9
NetU11_12: U14.16(IO46) ; port ESP_IO46
NetU11_14: U14.15(IO3) ; port ESP_IO3
NetU14_24: U14.24(IO47) ; port ESP_IO47
NetU14_28: U14.28(IO35) ; port ESP_IO35
NetU14_29: U14.29(IO36) ; port ESP_IO36
NetU14_30: U14.30(IO37) ; port ESP_IO37

Not connected (* = marked no-connect by the designer): SW2 3(MNT_1) 4(MNT_2)

### Layout directives
differential pair; differential pair class DIFF90: USB_N, USB_P

### Notes on the sheet
- For boards with Octal SPI flash/PSRAM memory embedded ESP32-S3-WROOM-1/1U modules, and boards with ESP32-S3-WROOM-2 modules, the pins GPIO35, GPIO36 and GPIO37 are used for the internal communication between ESP32-S3 and SPI flash/PSRAM memory, thus not available for external use.
- TX0: GPIO43
  RX0: GPIO44
  TX1: GPIO17
  RX1: GPIO18
  TX2: GPIO4
  RX2: GPIO5
- (in symbol USB-4) VDD; ESD; Protection

### Library data of the parts
C62 C67 = CMP-2006-02792-2: as C17 on sheet LR; Packaging: Tape and Reel; Width: 0.031inch; Termination: SMD/SMT; Package Quantity: 4000; Voltage Rating: 6.3V; Capacitance: 10uF; Case/Package: 0603; Min Operating Temperature: -55°C; Voltage: 6.3V; Length: 1.6mm; Thickness: 0.035inch; Lead Free: Lead Free; Depth: 0.8mm; Case Code (Imperial): 0603; Max Operating Temperature: 85°C; Material: Ceramic; Height: 0.8mm; Mount: Surface Mount; REACH SVHC: No SVHC; Radiation Hardening: No; Case Code (Metric): 1608
C63-C66 C68 C69 = CMP-2006-02792-2: as C18 on sheet LR; Packaging: Tape and Reel; Width: 0.031inch; Termination: SMD/SMT; Package Quantity: 4000; Voltage Rating: 6.3V; Case/Package: 0603; Min Operating Temperature: -55°C; Voltage: 6.3V; Length: 1.6mm; Thickness: 0.035inch; Lead Free: Lead Free; Depth: 0.8mm; Case Code (Imperial): 0603; Max Operating Temperature: 85°C; Material: Ceramic; Height: 0.8mm; Mount: Surface Mount; REACH SVHC: No SVHC; Radiation Hardening: No; Case Code (Metric): 1608
C70 C71 = CMP-2000-07546-2: Cap Ceramic 100nF 50V X7R 10% Pad SMD 0603 +125°C Automotive T/R; Weight: 7.1E-05oz; Composition: Ceramic; Max Operating Temperature: 125°C; Termination: SMD/SMT; Dielectric: X7R; Length: 1.6mm; Package Quantity: 1; REACH SVHC: No SVHC; Lead Free: Lead Free; Case Code (Metric): 1608; Min Operating Temperature: -55°C; Packaging: Tape and Reel; Tolerance: 10%; Voltage Rating: 50V; Case Code (Imperial): 0603; Capacitance: 100nF; Case/Package: 0603; Voltage Rating (DC): 50V; Depth: 0.8mm; Radiation Hardening: No; Ratings: AEC-Q200; Mount: Surface Mount; Voltage: 50V; Thickness: 0.035inch; Width: 0.8mm; Height: 0.8mm
J7 = USB-4: THT USB 2.0 A Connector WE-EPLE; Manufacturer: Würth Elektronik eiSos GmbH; PartNo: 8492121; ComponentLink1Description: Manufacturer; ComponentLink1URL: http://www.we-online.de; Created by: Christin Otto; Created Date: OCT-2014; ComponentLink2Description: Datasheet; ComponentLink2URL: http://www.we-online.de/katalog/media/pdf/8492121.pdf
R88-R91 = Res-SMD: Resistor 0603; Manufacturer: Generic Components; Class: Passive; Published: 08/06/2000; Publisher: Altium Hobart Technology Centre
SW1-SW3 = CMP-2000-05515-2: SWITCH TACTILE SPST-NO 0.05A 24V; Manufacturer: TE Connectivity; Manufacturer Part Number: 1825027-8; Operating Force: 1.6N; Contact Resistance: 100mΩ; Contact Current Rating: 50mA; Electromechanical Life: 100000Cycles; Temperature: -35°C to +85°C; Lead Free: Yes; Device Class L1: Electromechanical; ComponentLink2Description: Datasheet; Temperature Range Low: -35°C; Voltage Rating Dc: 24V; RoHS: TRUE; Mount: Through Hole; Temperature Range High: +85°C; Octopart: https://octopart.com/1825027-8-te+connectivity-41891101; ComponentLink2URL: https://www.te.com/commerce/DocumentDelivery/DDEController?Action=showdoc&DocId=Customer+Drawing%7F1825027%7FG4%7Fpdf%7FEnglish%7FENG_CD_1825027_G4.pdf%7F1825027-8; Height: 7.31mm; Automotive: No; Mouser Description: Tactile Switches R/A TACT 160G PB SWITCH; Digikey Description: SWITCH TACTILE SPST-NO 0.05A 24V; Category: Switch; Device Class L3: Pushbutton Switches; Package: 1825027-8; Device Class L2: Switches; Throw Configuration: SPST-NO
U13 = CMP-0062-01638-4: as U4 on sheet LR; ComponentLink1URL: http://www.ti.com/general/docs/lit/getliterature.tsp?genericPartNumber=LM1117-N&fileType=pdf; PinCount: 4; PackageDescription: Molded SOT-223, 6.50 x 3.56 x 1.6mm Body, 4 Lead, 2.3mm Pitch; Code_IPC: SOT223-4; PartNumber: LM1117MP-3.3/NOPB; Code_JEDEC: TO-261-AA; RoHS: Y; PackageReference: DCY0004A; ComponentLink1Description: Datasheet URL
U14 = ESP32-S3-WROOM-1-N16R8: Bluetooth, WiFi 802.11b/g/n, Bluetooth v5.0 Transceiver Module 2.4GHz PCB Trace Surface Mount; MF: Espressif Systems; SnapEDA_Link: https://www.snapeda.com/parts/ESP32-S3-WROOM-1-N16R8/Espressif+Systems/view-part/?ref=snap; Package: NON STANDARD Espressif Systems; Value: *; MP: ESP32-S3-WROOM-1-N16R8; Check_prices: https://www.snapeda.com/parts/ESP32-S3-WROOM-1-N16R8/Espressif+Systems/view-part/?ref=eda

## Sheet AI.SchDoc
size 304 x 304 mm; SheetNumber: 3; SheetTotal: 15
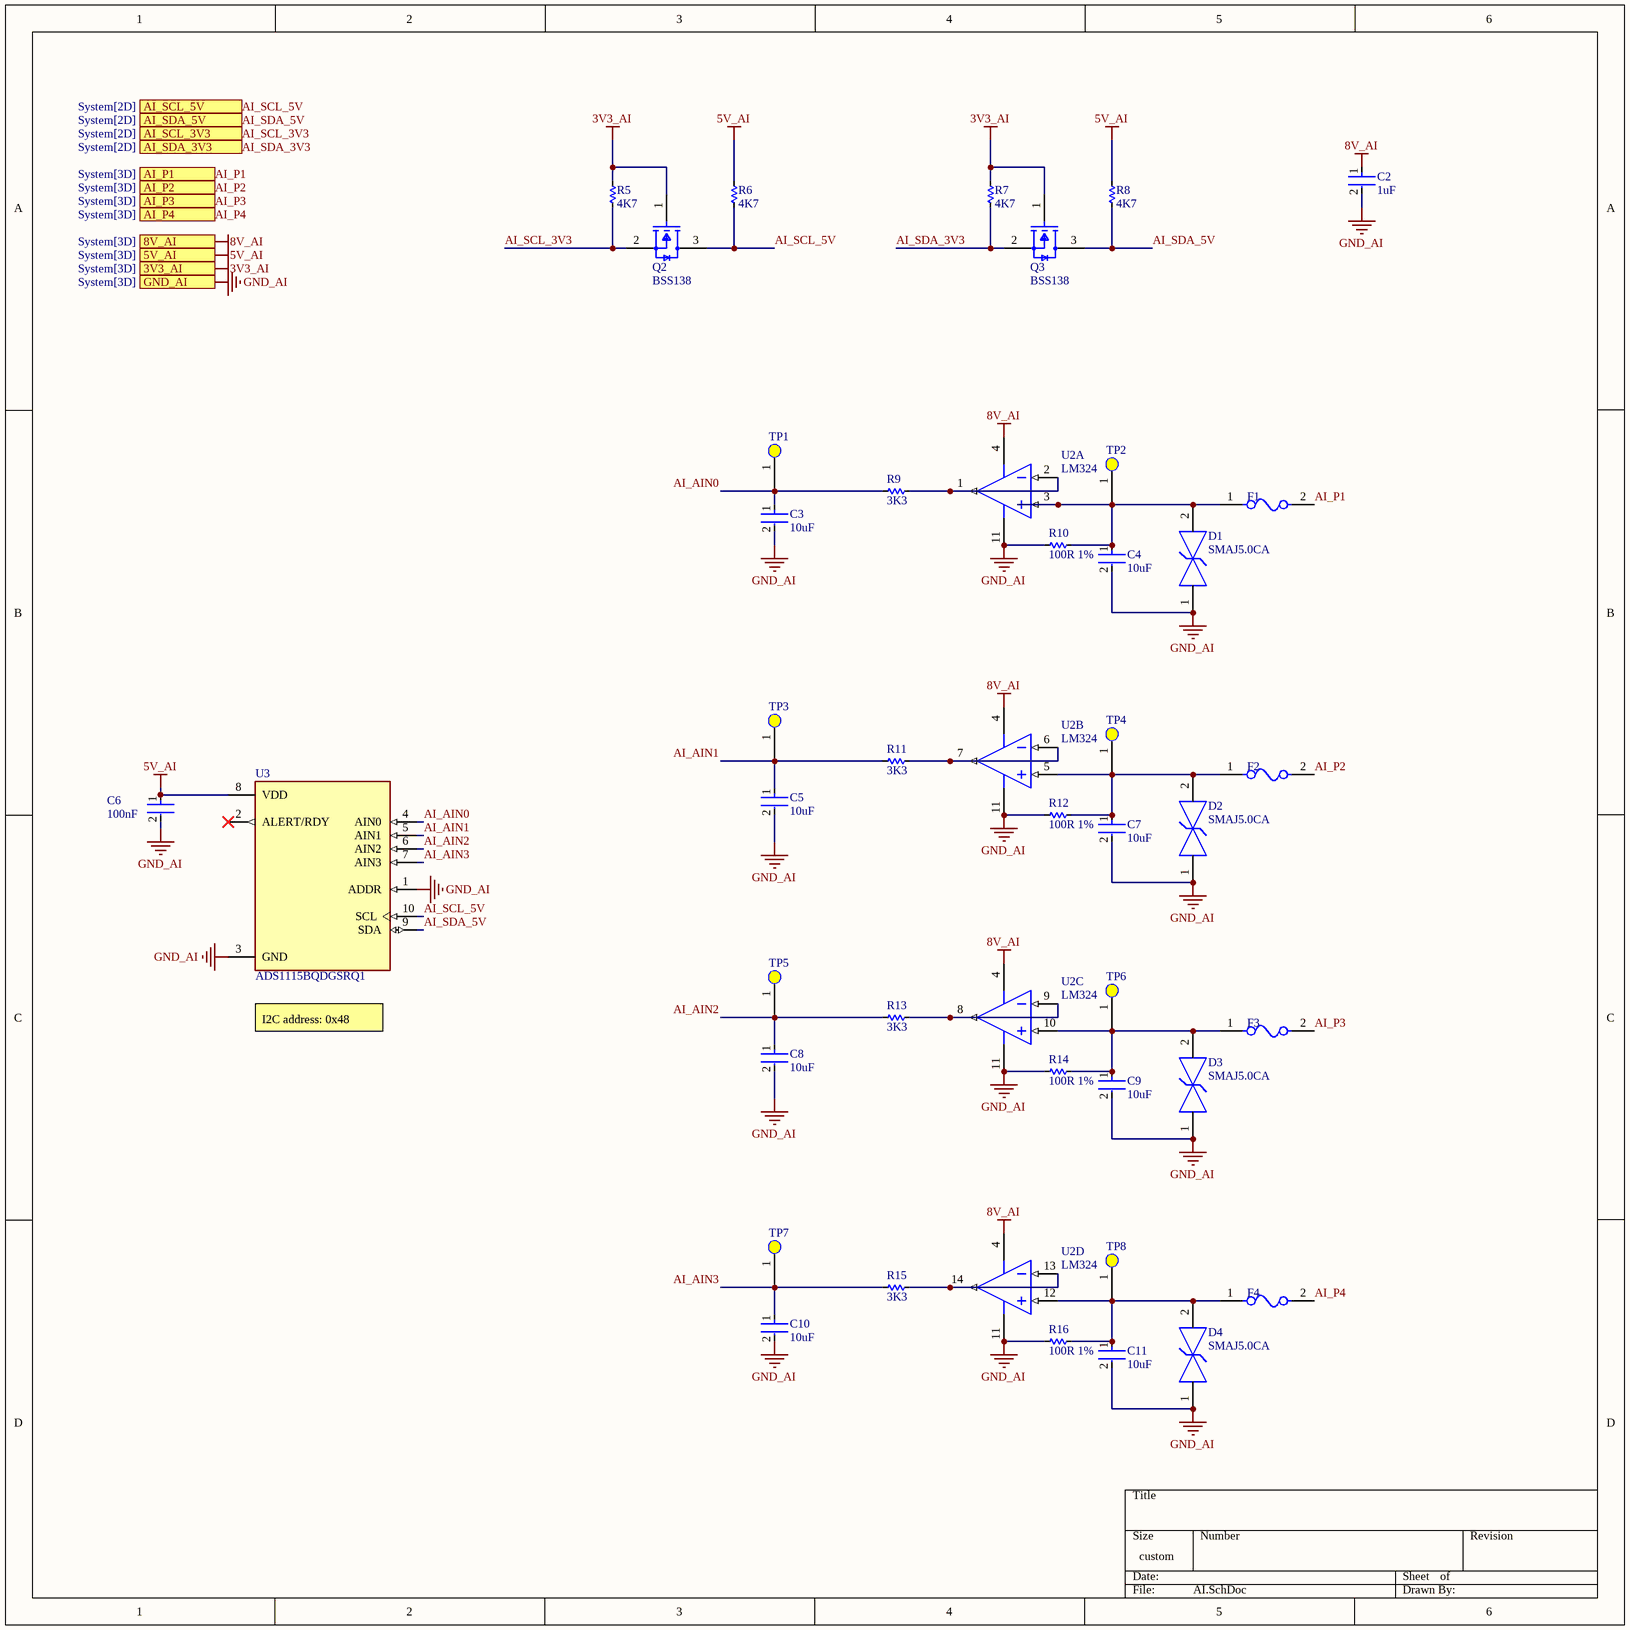
[diagram p5: AI.SchDoc]

### Parts
C2  1uF  [FP-GRM18-0_15-MFG]
C3  10uF  [FP-GRM18-0_15-MFG]
C4  10uF  [FP-GRM18-0_15-MFG]
C5  10uF  [FP-GRM18-0_15-MFG]
C6  100nF  [FP-GRM18-0_15-MFG]
C7  10uF  [FP-GRM18-0_15-MFG]
C8  10uF  [FP-GRM18-0_15-MFG]
C9  10uF  [FP-GRM18-0_15-MFG]
C10  10uF  [FP-GRM18-0_15-MFG]
C11  10uF  [FP-GRM18-0_15-MFG]
D1  SMAJ5.0CA  [FP-SMAJ-MFG]
D2  SMAJ5.0CA  [FP-SMAJ-MFG]
D3  SMAJ5.0CA  [FP-SMAJ-MFG]
D4  SMAJ5.0CA  [FP-SMAJ-MFG]
F1  CLA1683  [FP-0468-MFG]  (value not drawn)
F2  CLA1683  [FP-0468-MFG]  (value not drawn)
F3  CLA1683  [FP-0468-MFG]  (value not drawn)
F4  CLA1683  [FP-0468-MFG]  (value not drawn)
Q2  BSS138  [FP-318-08-IPC_B]
Q3  BSS138  [FP-318-08-IPC_B]
R5  4K7  [RES-SMD-0603]
R6  4K7  [RES-SMD-0603]
R7  4K7  [RES-SMD-0603]
R8  4K7  [RES-SMD-0603]
R9  3K3  [RES-SMD-0603]
R10  100R 1%  [RES-SMD-0805]
R11  3K3  [RES-SMD-0603]
R12  100R 1%  [RES-SMD-0805]
R13  3K3  [RES-SMD-0603]
R14  100R 1%  [RES-SMD-0805]
R15  3K3  [RES-SMD-0603]
R16  100R 1%  [RES-SMD-0805]
TP1  Test Point  [Test Point]  (value not drawn)
TP2  Test Point  [Test Point]  (value not drawn)
TP3  Test Point  [Test Point]  (value not drawn)
TP4  Test Point  [Test Point]  (value not drawn)
TP5  Test Point  [Test Point]  (value not drawn)
TP6  Test Point  [Test Point]  (value not drawn)
TP7  Test Point  [Test Point]  (value not drawn)
TP8  Test Point  [Test Point]  (value not drawn)
U2  LM324  [D0014A_N]  (parts A,B,C,D of 4)
U3  ADS1115BQDGSRQ1  [SOP50P490X110-10N]

### Ports
3V3_AI (see System[3D]), 5V_AI (see System[3D]), 8V_AI (see System[3D]), AI_P1 (see System[3D]), AI_P2 (see System[3D]), AI_P3 (see System[3D]), AI_P4 (see System[3D]), AI_SCL_3V3 (see System[2D]), AI_SCL_5V (see System[2D]), AI_SDA_3V3 (see System[2D]), AI_SDA_5V (see System[2D]), GND_AI (see System[3D])

### Nets
3V3_AI: Q2.1(G) Q3.1(G) R5.1 R7.1 ; port 3V3_AI  [project net 3V3]
5V_AI: C6.1 R6.1 R8.1 U3.8(VDD) ; port 5V_AI  [project net 5V]
8V_AI: C2.1 U2.4(VCC+) ; port 8V_AI  [project net 8V]
GND_AI: C2.2 C3.2 C4.2 C5.2 C6.2 C7.2 C8.2 C9.2 C10.2 C11.2 D1.1 D2.1 D3.1 D4.1 R10.2 R12.2 R14.2 R16.2 U2.11(VCC-) U3.1(ADDR) U3.3(GND) ; port GND_AI  [project net GND]
AI_AIN0: C3.1 R9.2 TP1.1(Test_Point) U3.4(AIN0)
AI_AIN1: C5.1 R11.2 TP3.1(Test_Point) U3.5(AIN1)
AI_AIN2: C8.1 R13.2 TP5.1(Test_Point) U3.6(AIN2)
AI_AIN3: C10.1 R15.2 TP7.1(Test_Point) U3.7(AIN3)
AI_P1: F1.2 ; port AI_P1
AI_P2: F2.2 ; port AI_P2
AI_P3: F3.2 ; port AI_P3
AI_P4: F4.2 ; port AI_P4
AI_SCL_3V3: Q2.2(S) R5.2 ; port AI_SCL_3V3
AI_SCL_5V: Q2.3(D) R6.2 U3.10(SCL) ; port AI_SCL_5V
AI_SDA_3V3: Q3.2(S) R7.2 ; port AI_SDA_3V3
AI_SDA_5V: Q3.3(D) R8.2 U3.9(SDA) ; port AI_SDA_5V
NetC4_1: C4.1 D1.2 F1.1 R10.1 TP2.1(Test_Point) U2.3(IN1+)
NetC7_1: C7.1 D2.2 F2.1 R12.1 TP4.1(Test_Point) U2.5(IN2+)
NetC9_1: C9.1 D3.2 F3.1 R14.1 TP6.1(Test_Point) U2.10(IN3+)
NetC11_1: C11.1 D4.2 F4.1 R16.1 TP8.1(Test_Point) U2.12(IN4+)
NetR9_1: R9.1 U2.1(OUT1) U2.2(IN1-)
NetR11_1: R11.1 U2.6(IN2-) U2.7(OUT2)
NetR13_1: R13.1 U2.8(OUT3) U2.9(IN3-)
NetR15_1: R15.1 U2.13(IN4-) U2.14(OUT4)

Not connected (* = marked no-connect by the designer): U3 2(ALERT/RDY)*

### Notes on the sheet
- (near U3) I2C address: 0x48

### Library data of the parts
C2 = CMP-2000-05448-2: CAP CER 1UF 10V X5R 0603; Manufacturer Part Number: GRM188R61A106KE69D; Manufacturer: Murata; Temperature Coefficient: 15%; Value: 10uF; Material: Ceramic; Tolerance: 10%; Device Class L1: Passive Components; ComponentLink2Description: Datasheet; Height: 0.95mm; Package: GRM18-0.15; Octopart: https://octopart.com/grm188r61a106ke69d-murata-22851381; Digikey Description: CAP CER 10UF 10V X5R 0603; Temperature Range High: +85°C; Temperature Range Low: -55°C; Temperature Characteristic: X5R; Capacitance: 10uF; RoHS: TRUE; Device Class L2: Capacitors; ComponentLink2URL: https://search.murata.co.jp/Ceramy/image/img/A01X/G101/ENG/GRM188R61A106KE69-01A.pdf; Device Class L3: Ceramic Capacitors; Lead Free: Yes; Mouser Description: Multilayer Ceramic Capacitors MLCC - SMD/SMT 0603 10uF 10volts X5R + - 10%; Category: Cap; Voltage Rating: 10V; Temperature: -55°C to +85°C; Automotive: No
C3-C5 C7-C11 = CMP-2000-05448-2: CAP CER 10UF 10V X5R 0603; Manufacturer Part Number: GRM188R61A106KE69D; Manufacturer: Murata; Temperature Coefficient: 15%; Material: Ceramic; Tolerance: 10%; Device Class L1: Passive Components; ComponentLink2Description: Datasheet; Height: 0.95mm; Package: GRM18-0.15; Octopart: https://octopart.com/grm188r61a106ke69d-murata-22851381; Value: 10uF; Digikey Description: CAP CER 10UF 10V X5R 0603; Temperature Range High: +85°C; Temperature Range Low: -55°C; Temperature Characteristic: X5R; Capacitance: 10uF; RoHS: TRUE; Device Class L2: Capacitors; ComponentLink2URL: https://search.murata.co.jp/Ceramy/image/img/A01X/G101/ENG/GRM188R61A106KE69-01A.pdf; Device Class L3: Ceramic Capacitors; Lead Free: Yes; Mouser Description: Multilayer Ceramic Capacitors MLCC - SMD/SMT 0603 10uF 10volts X5R + - 10%; Category: Cap; Voltage Rating: 10V; Temperature: -55°C to +85°C; Automotive: No
C6 = CMP-2000-05448-2: as C61 on sheet uSD; Device Class L1: Passive Components; ComponentLink2Description: Datasheet; Height: 0.95mm; Package: GRM18-0.15; Octopart: https://octopart.com/grm188r61a106ke69d-murata-22851381; Digikey Description: CAP CER 10UF 10V X5R 0603; Temperature Range High: +85°C; Temperature Range Low: -55°C; Temperature Characteristic: X5R; Capacitance: 10uF; RoHS: TRUE; Device Class L2: Capacitors; ComponentLink2URL: https://search.murata.co.jp/Ceramy/image/img/A01X/G101/ENG/GRM188R61A106KE69-01A.pdf; Device Class L3: Ceramic Capacitors; Lead Free: Yes; Mouser Description: Multilayer Ceramic Capacitors MLCC - SMD/SMT 0603 10uF 10volts X5R + - 10%; Category: Cap; Voltage Rating: 10V; Temperature: -55°C to +85°C; Automotive: No
D1-D4 = CMP-08607-000067-1: SMAJ5.0CA TVS Diode 5V 400W SMA(DO-214AC); Manufacturer: Littelfuse Inc; Manufacturer Part Number: SMAJ58CA; Reverse Standoff Voltage: 58V; Breakdown Voltage: 64.4V; Peak Pulse Current: 4.3A; Direction: Bidirectional; Clamping Voltage: 93.6V; Number Of Channels: 1; Max Junction Temp: +150°C; Device Class L2: TVS Diodes; ComponentLink2Description: Datasheet; Lead Free: Yes; Height: 2.29mm; Automotive: No; Package: SMAJ; Digikey Description: TVS DIODE 58V 93.6V DO214AC; Temperature Range Low: -65°C; Device Class L1: Circuit Protection; Temperature Range High: +150°C; Mouser Description: In a Pack of 25, Littelfuse SMAJ58CA, Bi-Directional TVS Diode, 400W, 2-Pin DO-214AC; Octopart: https://octopart.com/smaj58ca-littelfuse-350202; ComponentLink2URL: https://www.littelfuse.com/~/media/electronics/datasheets/tvs_diodes/littelfuse_tvs_diode_smaj_datasheet.pdf.pdf; Temperature: -65°C to +150°C; Peak Pulse Power: 400W; Device Class L3: unset; Category: Diode; RoHS: TRUE; ComponentLink3Description: New link; ComponentLink3URL: https://linhkien.cxtvn.com/2607-smaj50ca-tvs-diode-5v-400w-smado-214ac.html
F1-F4 = CMP-08605-000076-1: 1206 0.05A 60V JZ PTC SMD; Manufacturer Part Number: 0468.500NR; Manufacturer: Littelfuse; Fuse Voltage Drop: 156.77mV; Fuse I2T: 0.031A2Sec; Fuse Interrupt Dc Current: 50A; Fuse Current: 0.5A; Resistance: 0.27Ω; Max Fuse Dc Voltage: 63V; Fuse Blow Speed: Slow; Value: 0.27Ω; Package: 0468; Digikey Description: FUSE BOARD MOUNT 500MA 63VAC/VDC; Mouser Description: Surface Mount Fuses 63V .5A Slo-Blo; Temperature Range High: +90°C; Lead Free: Yes; Height: 0.762mm; Device Class L1: Circuit Protection; Category: Fuse; Octopart: https://octopart.com/0468.500nr-littelfuse-672821; Fuse Interrupt Ac Current: 50A; Temperature Range Low: -55°C; Automotive: No; ComponentLink2URL: https://www.littelfuse.com/~/media/electronics/datasheets/fuses/littelfuse_fuse_468_datasheet.pdf.pdf; ComponentLink2Description: Datasheet; RoHS: TRUE; Max Fuse Ac Voltage: 63V; Temperature: -55°C to +90°C; Device Class L2: Fuses; Device Class L3: unset; Voltage Rating: 63V
Q2 Q3 = CMP-07173-000101-1: MOSFET N-CH 50V 220MA SOT-23; Turn-Off Delay Time: 20ns; Element Configuration: Single; Rds On Max: 3.5R; Gate to Source Voltage (Vgs): 20V; Threshold Voltage: 1.3V; Number of Elements: 1; Power Dissipation: 360mW; Rise Time: 9ns; Turn-On Delay Time: 2.5ns; Input Capacitance: 27pF; On-State Resistance: 6R; Lead Free: Lead Free; Length: 2.92mm; Width: 1.3mm; Drain to Source Breakdown Voltage: 50V; Min Operating Temperature: -55°C; REACH SVHC: No SVHC; Packaging: Tape and Reel; Radiation Hardening: No; Height: 0.93mm; Drain to Source Voltage (Vdss): 50V; Current Rating: 220mA; Voltage Rating (DC): 50V; Weight: 0.03g; Continuous Drain Current (ID): 220mA; Number of Pins: 3; Nominal Vgs: 1.3V; Max Power Dissipation: 360mW; Fall Time: 9ns; Drain to Source Resistance: 3.5R; Contact Plating: Tin; Case/Package: SOT-23; Package Quantity: 1; Dual Supply Voltage: 50V; Mount: Surface Mount; Termination: SMD/SMT; Max Operating Temperature: 150°C
R5-R9 R11 R13 R15 = Res-SMD: as R17 on sheet MB; Published: 08/06/2000; Publisher: Altium Hobart Technology Centre
R10 R12 R14 R16 = Res-SMD: Res 0805 1%; Manufacturer: Generic Components; Class: Passive; Published: 08/06/2000; Publisher: Altium Hobart Technology Centre
U2 = CMP-0017-00129-2: JFET-Input Operational Amplifier, 7 to 36 V, 0 to 70 degC, 14-pin SOIC (D14), Green (RoHS & no Sb/Br); PartNumber: TL084CDR; Manufacturer: Texas Instruments; Sub Family: General Purpose Amplifier, High Supply Voltage Amplifier (>=30V); CMRR(Min)(dB): 70; Vio (25C)(Max)(mV): 15; Number of Channels: 4; Slew Rate(Typ)(V/us): 13; Iq per channel(Max)(mA): 2.8; Rating: Catalog; IIB(Max)(pA): 400; Total Supply Voltage(Min)(+5V is 5, +/-5V is 10): 7; Vn at 1kHz(Typ)(nV/rtHz): 18; Total Supply Voltage(Max)(+5V is 5, +/-5V is 10): 36; GBW(Typ)(MHz): 3; ComponentLink2Description: Datasheet; Eco-Plan: Green (RoHS & no Sb/Br); ComponentLink1Description: Manufacturer URL; PackageVersion: 4040047-5/M, 06/2011; ComponentLink2URL: http://www.ti.com/lit/ds/symlink/tl084.pdf; Mounting Technology: Surface Mount; ComponentLink3Description: Package Specification; ComponentLink3URL: http://www.ti.com/lit/ml/mpds177g/mpds177g.pdf; DatasheetVersion: SLOS081G; PackageDescription: 14-Pin Plastic Small Outline, Body 8.65 x 3.90 mm, Pitch 1.27 mm; PackageReference: D0014A; Offset Drift(Typ)(uV/C): 18; Code_JEDEC: MS-012; ComponentLink1URL: http://www.ti.com/
U3 = ADS1115BQDGSRQ1: Automotive 16-bit, 860-SPS, 4-ch, delta-sigma ADC with PGA, oscillator, VREF, comparator and I2C; MF: Texas Instruments; SnapEDA_Link: https://www.snapeda.com/parts/ADS1115BQDGSRQ1/Texas+Instruments/view-part/?ref=snap; Package: VSSOP-10 Texas Instruments; Value: *; MP: ADS1115BQDGSRQ1; Check_prices: https://www.snapeda.com/parts/ADS1115BQDGSRQ1/Texas+Instruments/view-part/?ref=eda